# EasyEDA schematic 2 HF Upconverter (TH)_ Power circuit.json
TITLE: HF Upconverter (TH): Power circuit; REV: 3.4.EE; Date: 2018-03-02; Sheet: 1/1; Drawn By: IgrikXD
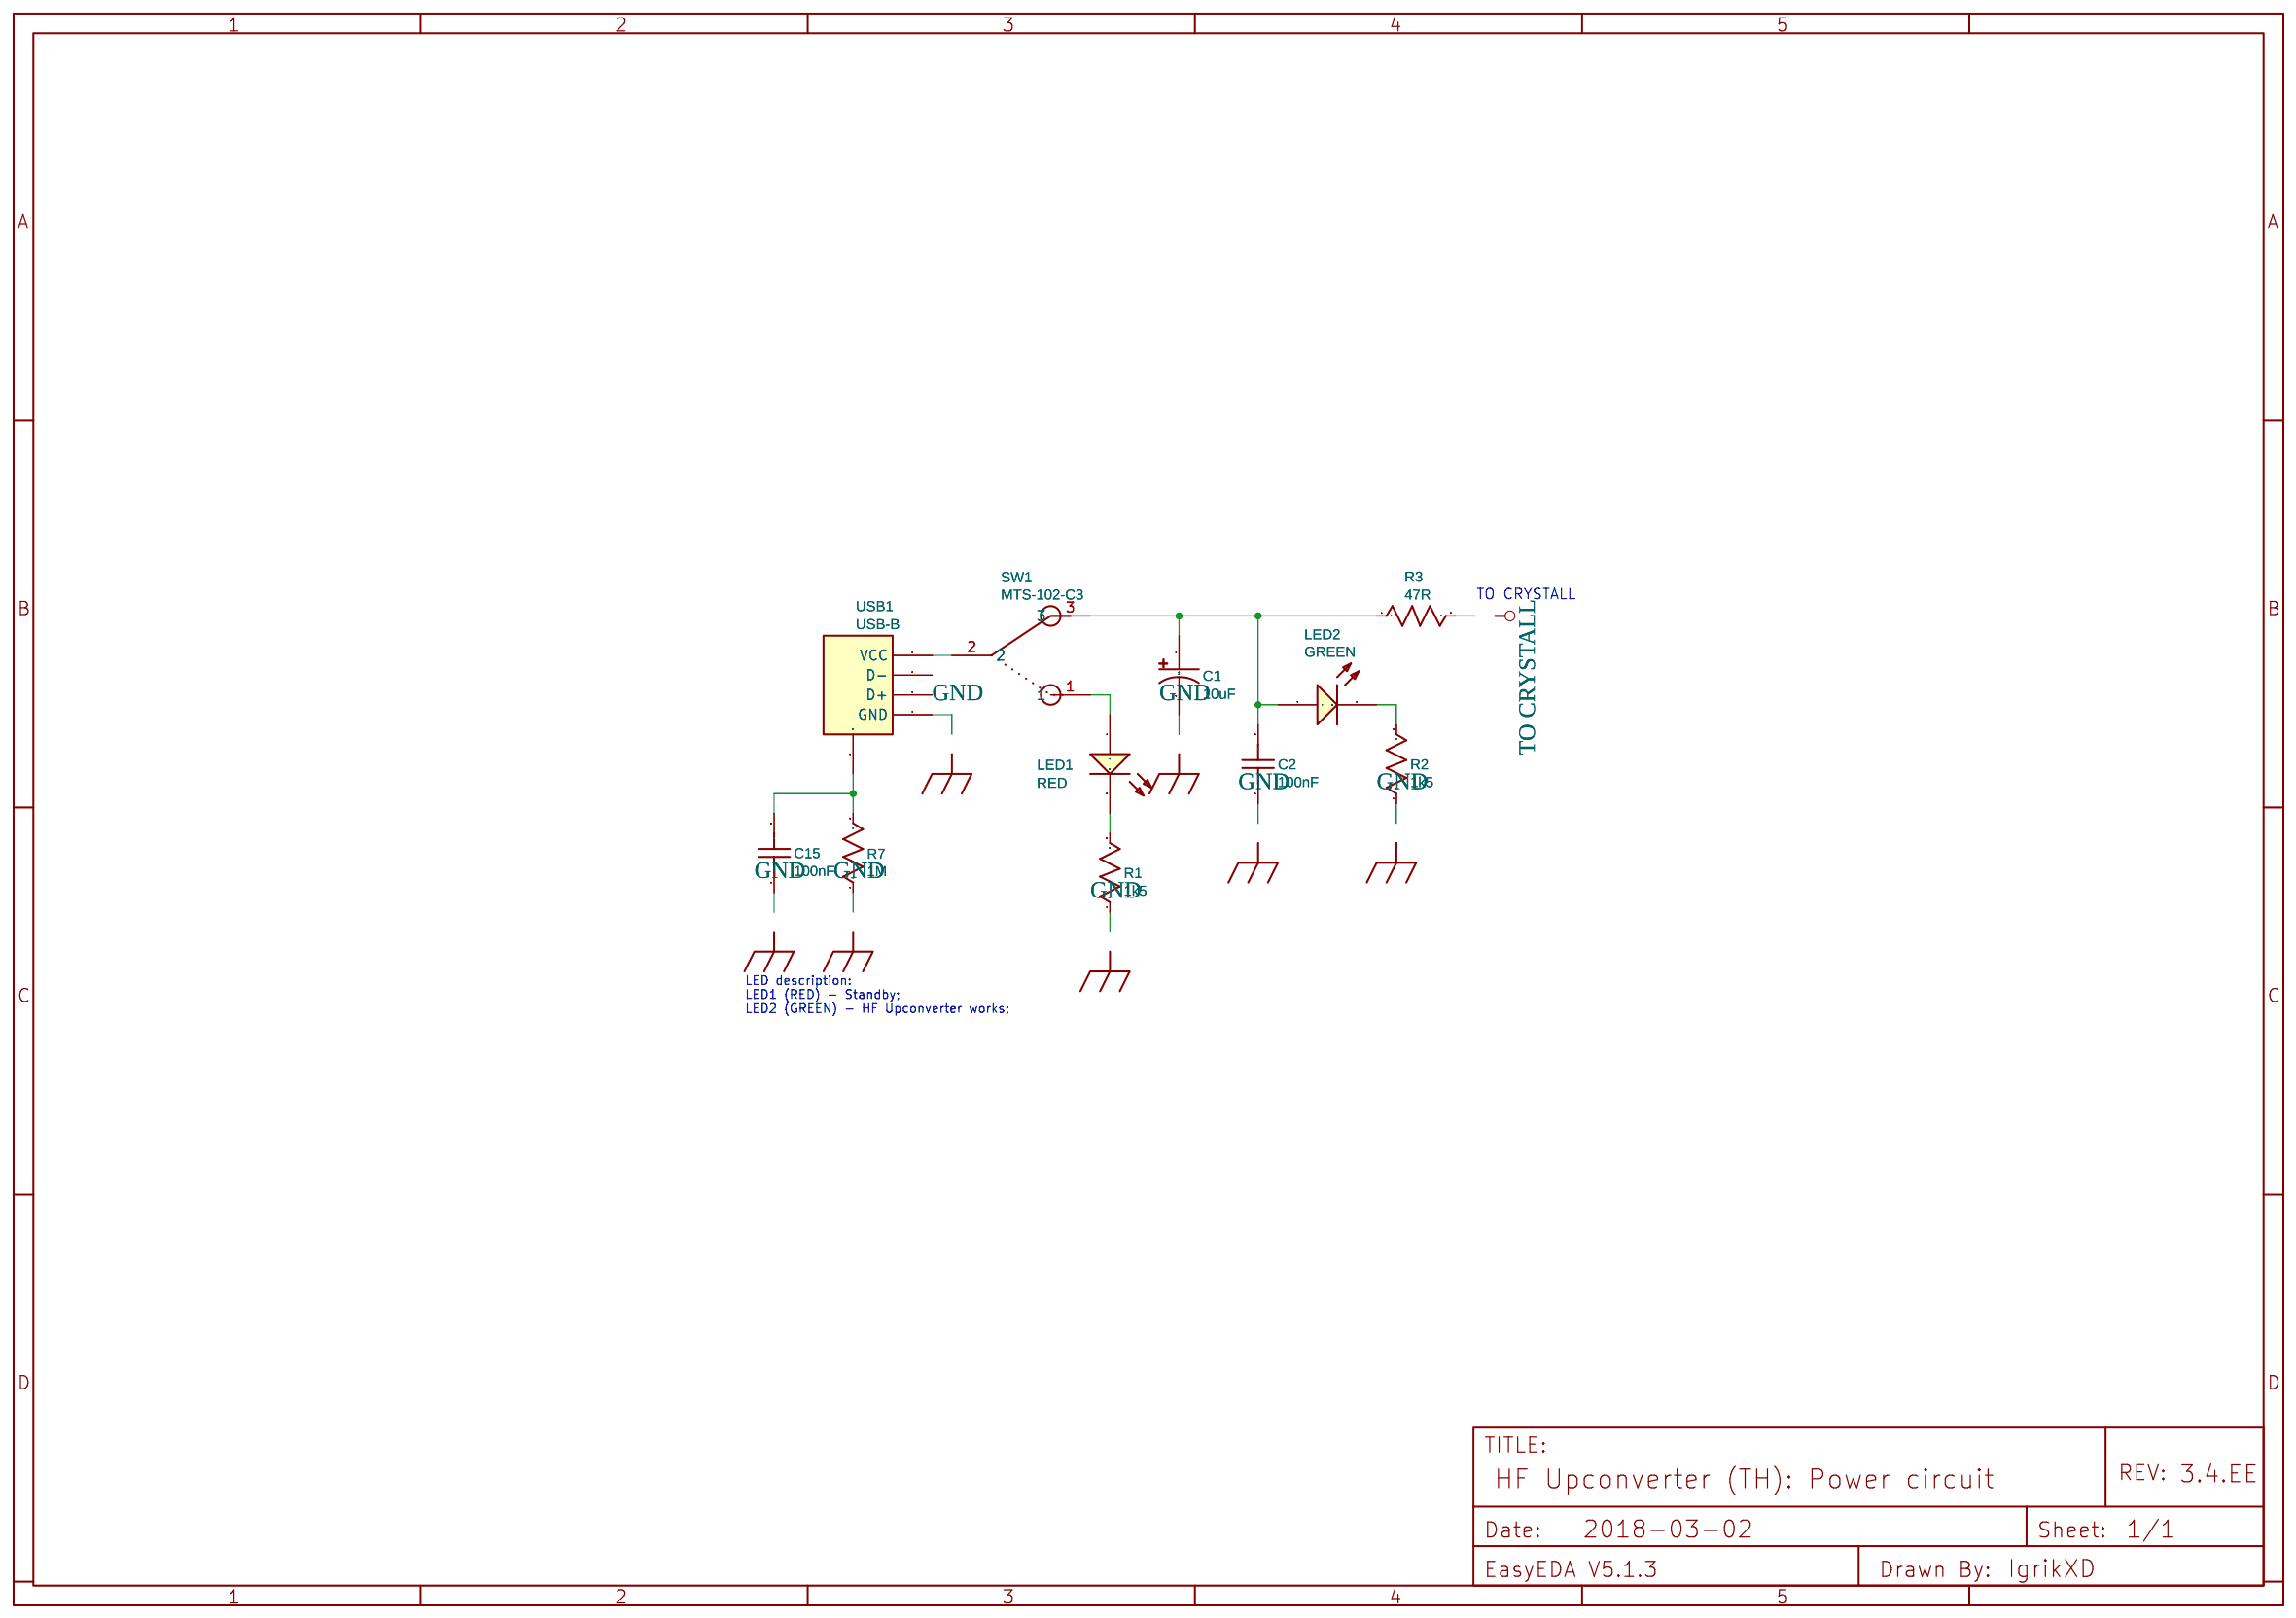
[diagram p0: schematic sheet]

## Parts
C1  10uF  [CAP-D5.0XF2.0]
C2  100nF  [RAD-0.2]
C15  100nF  [RAD-0.2]
LED1  RED  [LED-3MM/2.54]
LED2  GREEN  [LED-3MM/2.54]
R1  1k5  [AXIAL-0.3]
R2  1k5  [AXIAL-0.3]
R3  47R  [AXIAL-0.3]
R7  1M  [AXIAL-0.3]
SW1  MTS-102-C3  [MTS-102-C3]
USB1  USB-B  [USB TYPE B]

## Library data of the parts
C1 = Capacitor: Manufacturer Part: 10uF 16V 3*5; Supplier: LCSC; LCSC: C43798; Manufacturer: LCSC
C2 C15 = Capacitor: Manufacturer Part: Monolithic0805B104J500F3; Supplier: LCSC; LCSC: C110282; Manufacturer: FH
LED1 = -: LCSC: C2155; Supplier: LCSC; Manufacturer: KENTO; Manufacturer Part: 3AR4PD08
LED2 = -: LCSC: C17233; Supplier: LCSC; Manufacturer: KENTO; Manufacturer Part: 3CG4HD01
R1 R2 = Resistor: Manufacturer Part: MF1/4W-1.5KΩ±1% T52; Supplier: LCSC; LCSC: C119328; Manufacturer: CCO
R3 = Resistor: Manufacturer Part: MF1/4W-47Ω±1% T52; Supplier: LCSC; LCSC: C119296; Manufacturer: CCO
R7 = Resistor: Manufacturer Part: MFR0W4F1004A50; Supplier: LCSC; LCSC: C58596; Manufacturer: UniOhm
SW1 = -: Contributor: snhunter; sourceId: LjTecMmIi
USB1 = -: Supplier: LCSC; Manufacturer: LCSC; Manufacturer Part: USB BFemale90 White plastic; LCSC: C46393

## Nets
GND: C1.2 C2.1 C15.1 R1.1 R2.1 R7.1 USB1.4(GND)
TO CRYSTALL: R3.2
Net-(C1-1): C1.1 C2.2 LED2.1(A) R3.1 SW1.3
Net-(C15-2): C15.2 R7.2 USB1.5(CASE)
Net-(LED1-1): LED1.1(A) SW1.1
Net-(LED1-2): LED1.2(C) R1.2
Net-(LED2-2): LED2.2(C) R2.2
Net-(SW1-2): SW1.2 USB1.1(VCC)

Not connected (* = marked no-connect by the designer): USB1 2(D-) 3(D+)

## Notes on the sheet
- TO CRYSTALL
- LED description:
  LED1 (RED) - Standby;
  LED2 (GREEN) - HF Upconverter works;
